# EasyEDA Pro project sucaiku.epro

# Schematic bta

## Sheets
1 Master control circuit
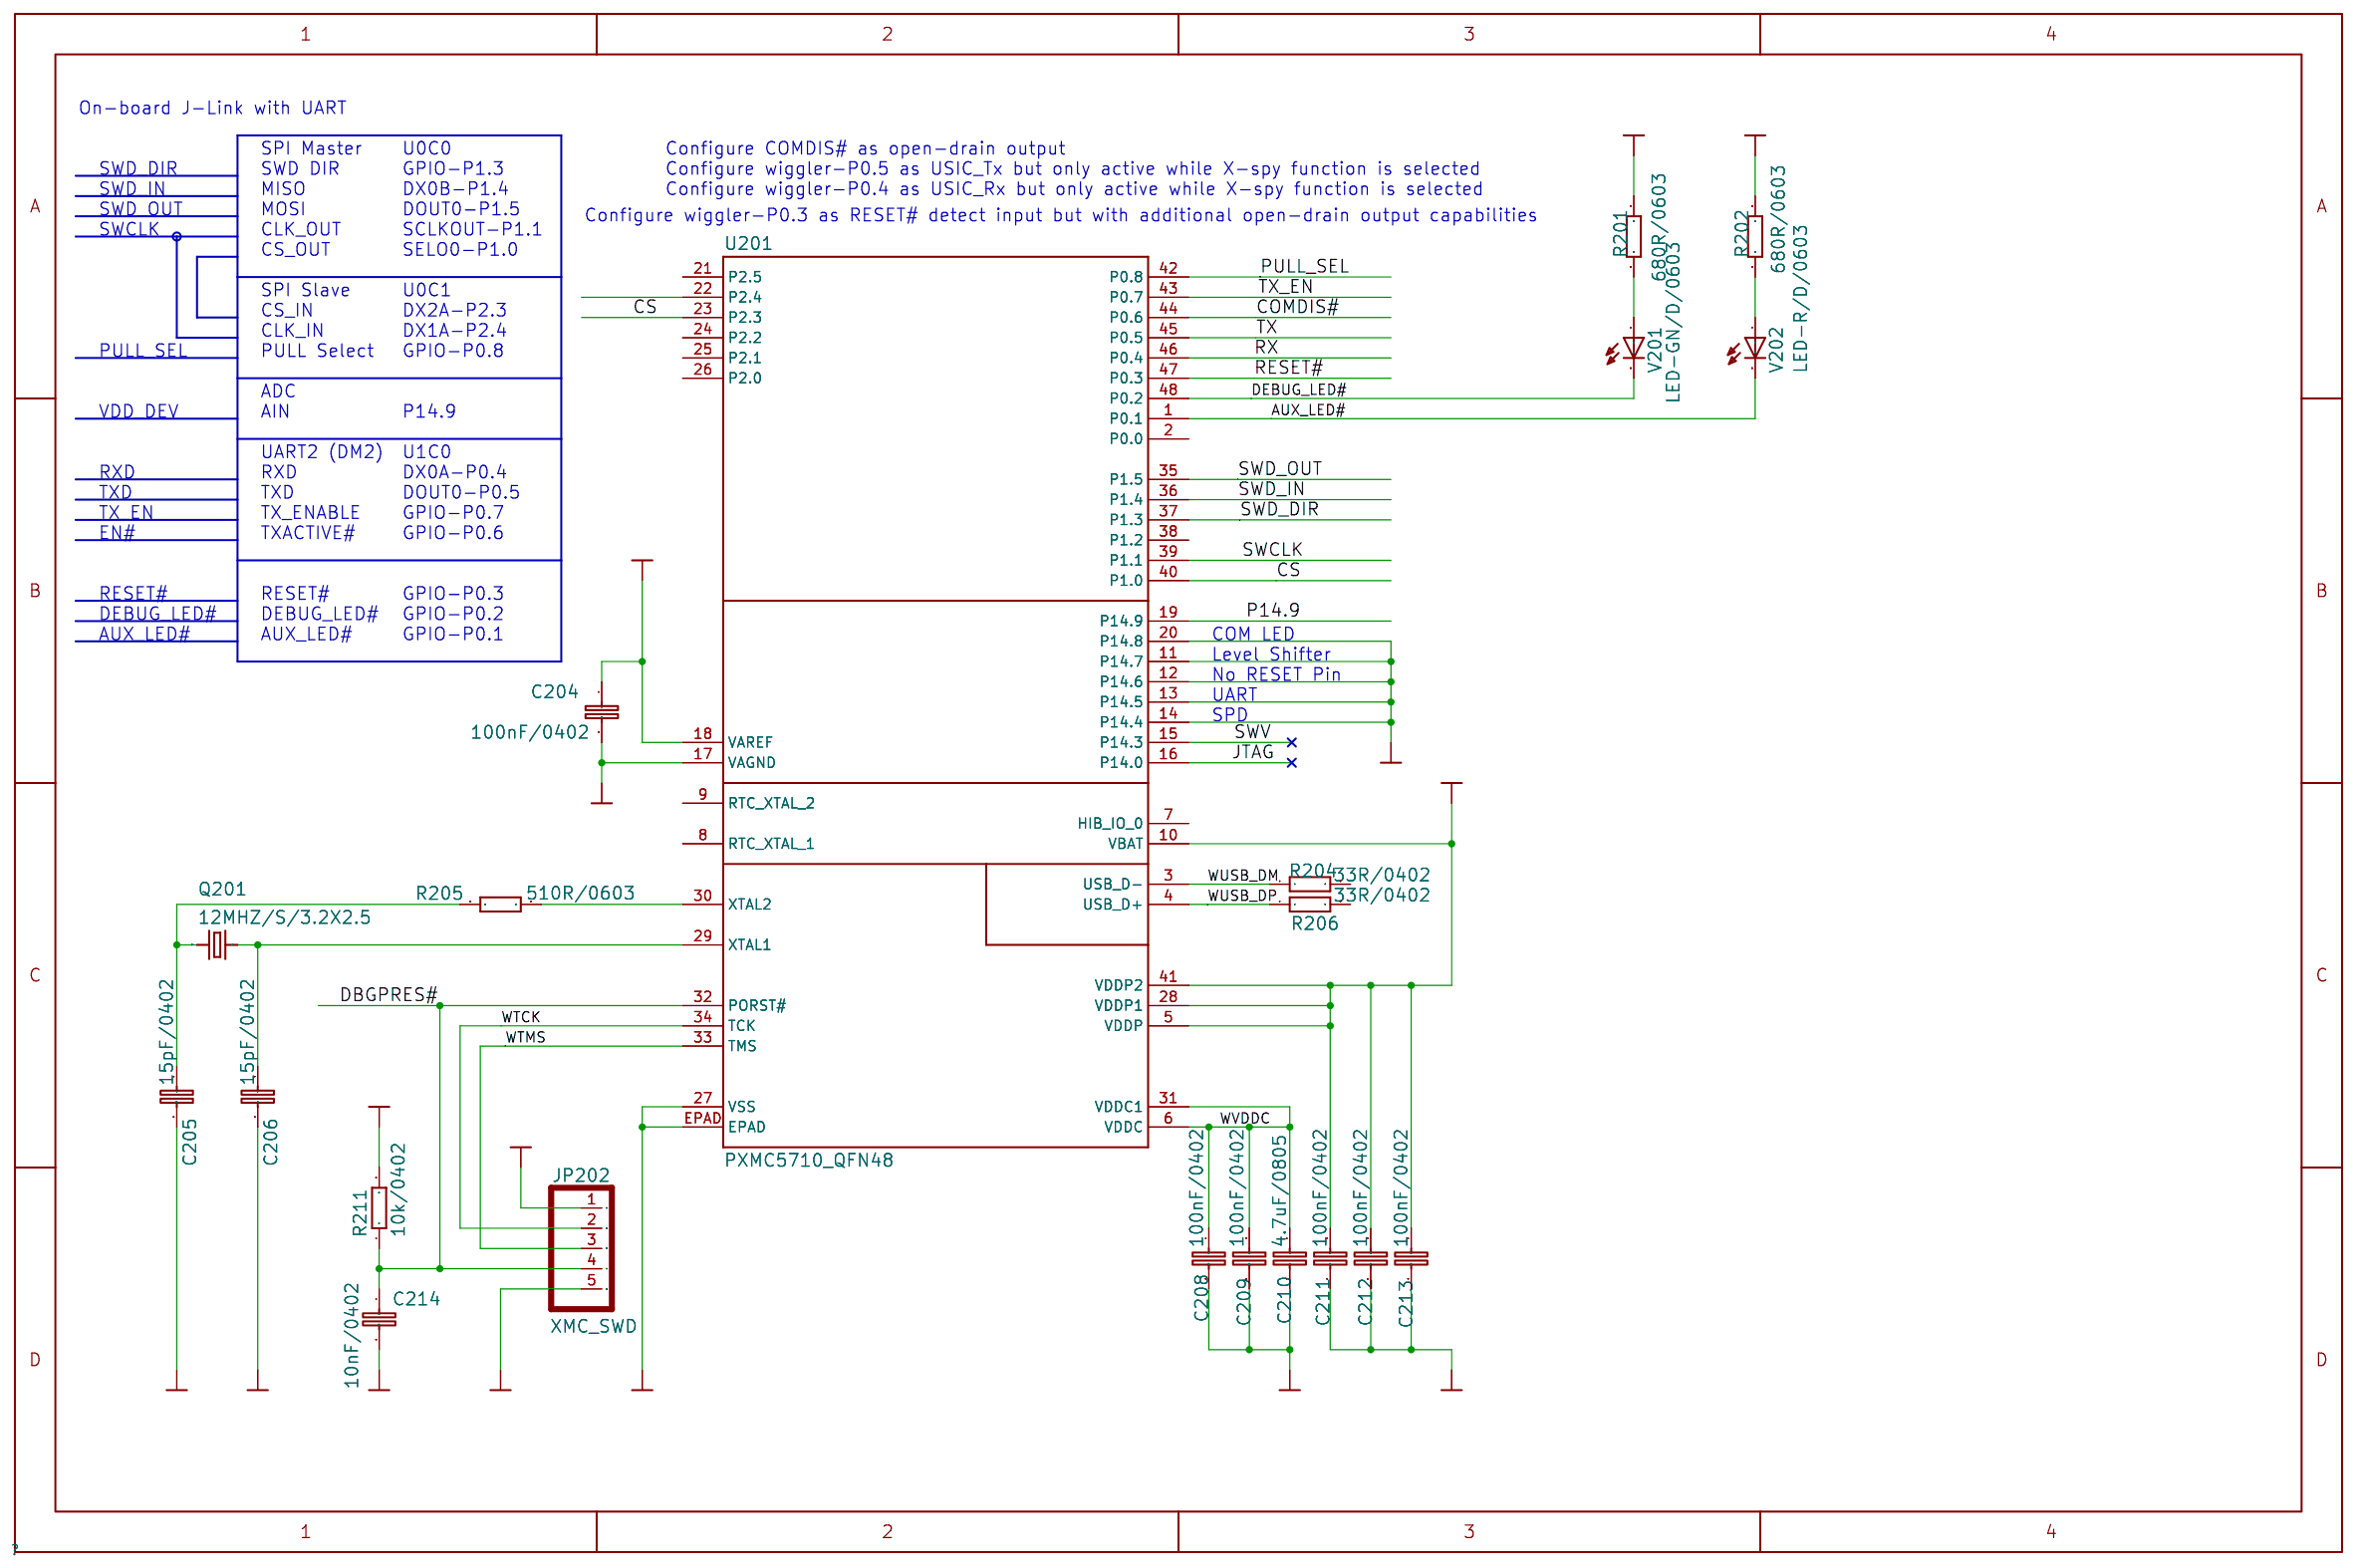
[diagram p0: Master control circuit]
2 Potentiometer and LEDs
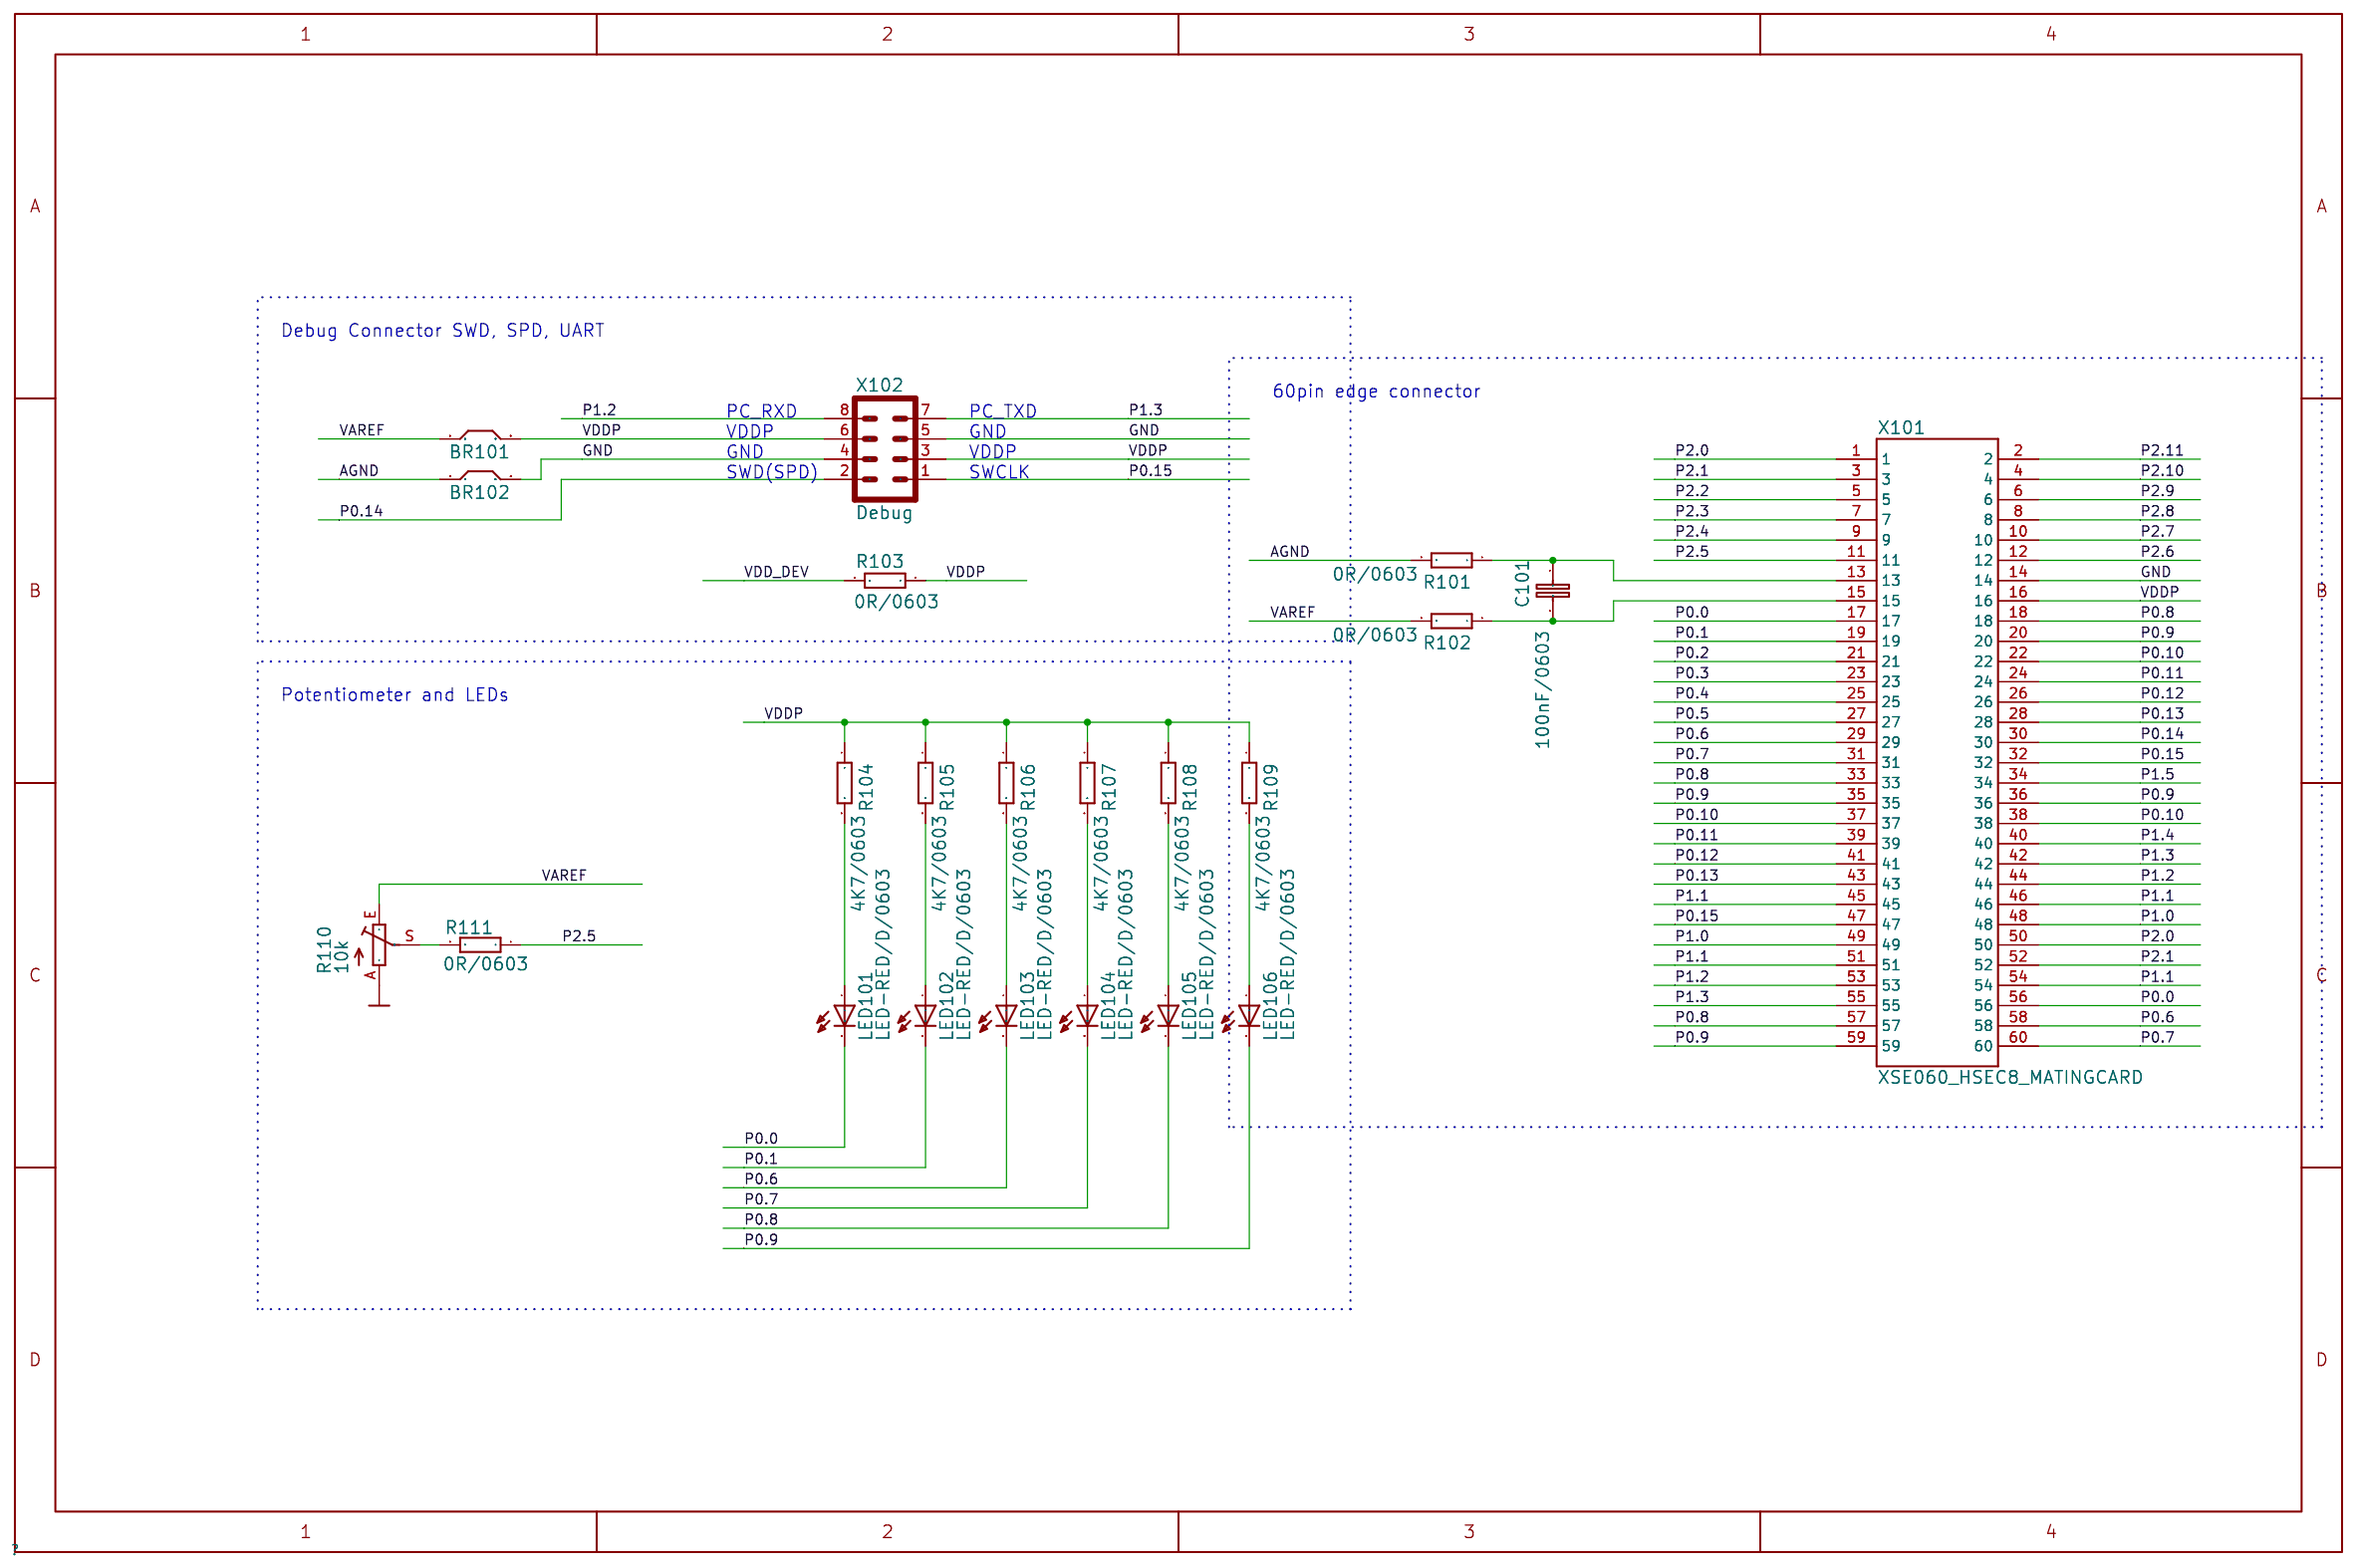
[diagram p1: Potentiometer and LEDs]
3 Power Supply
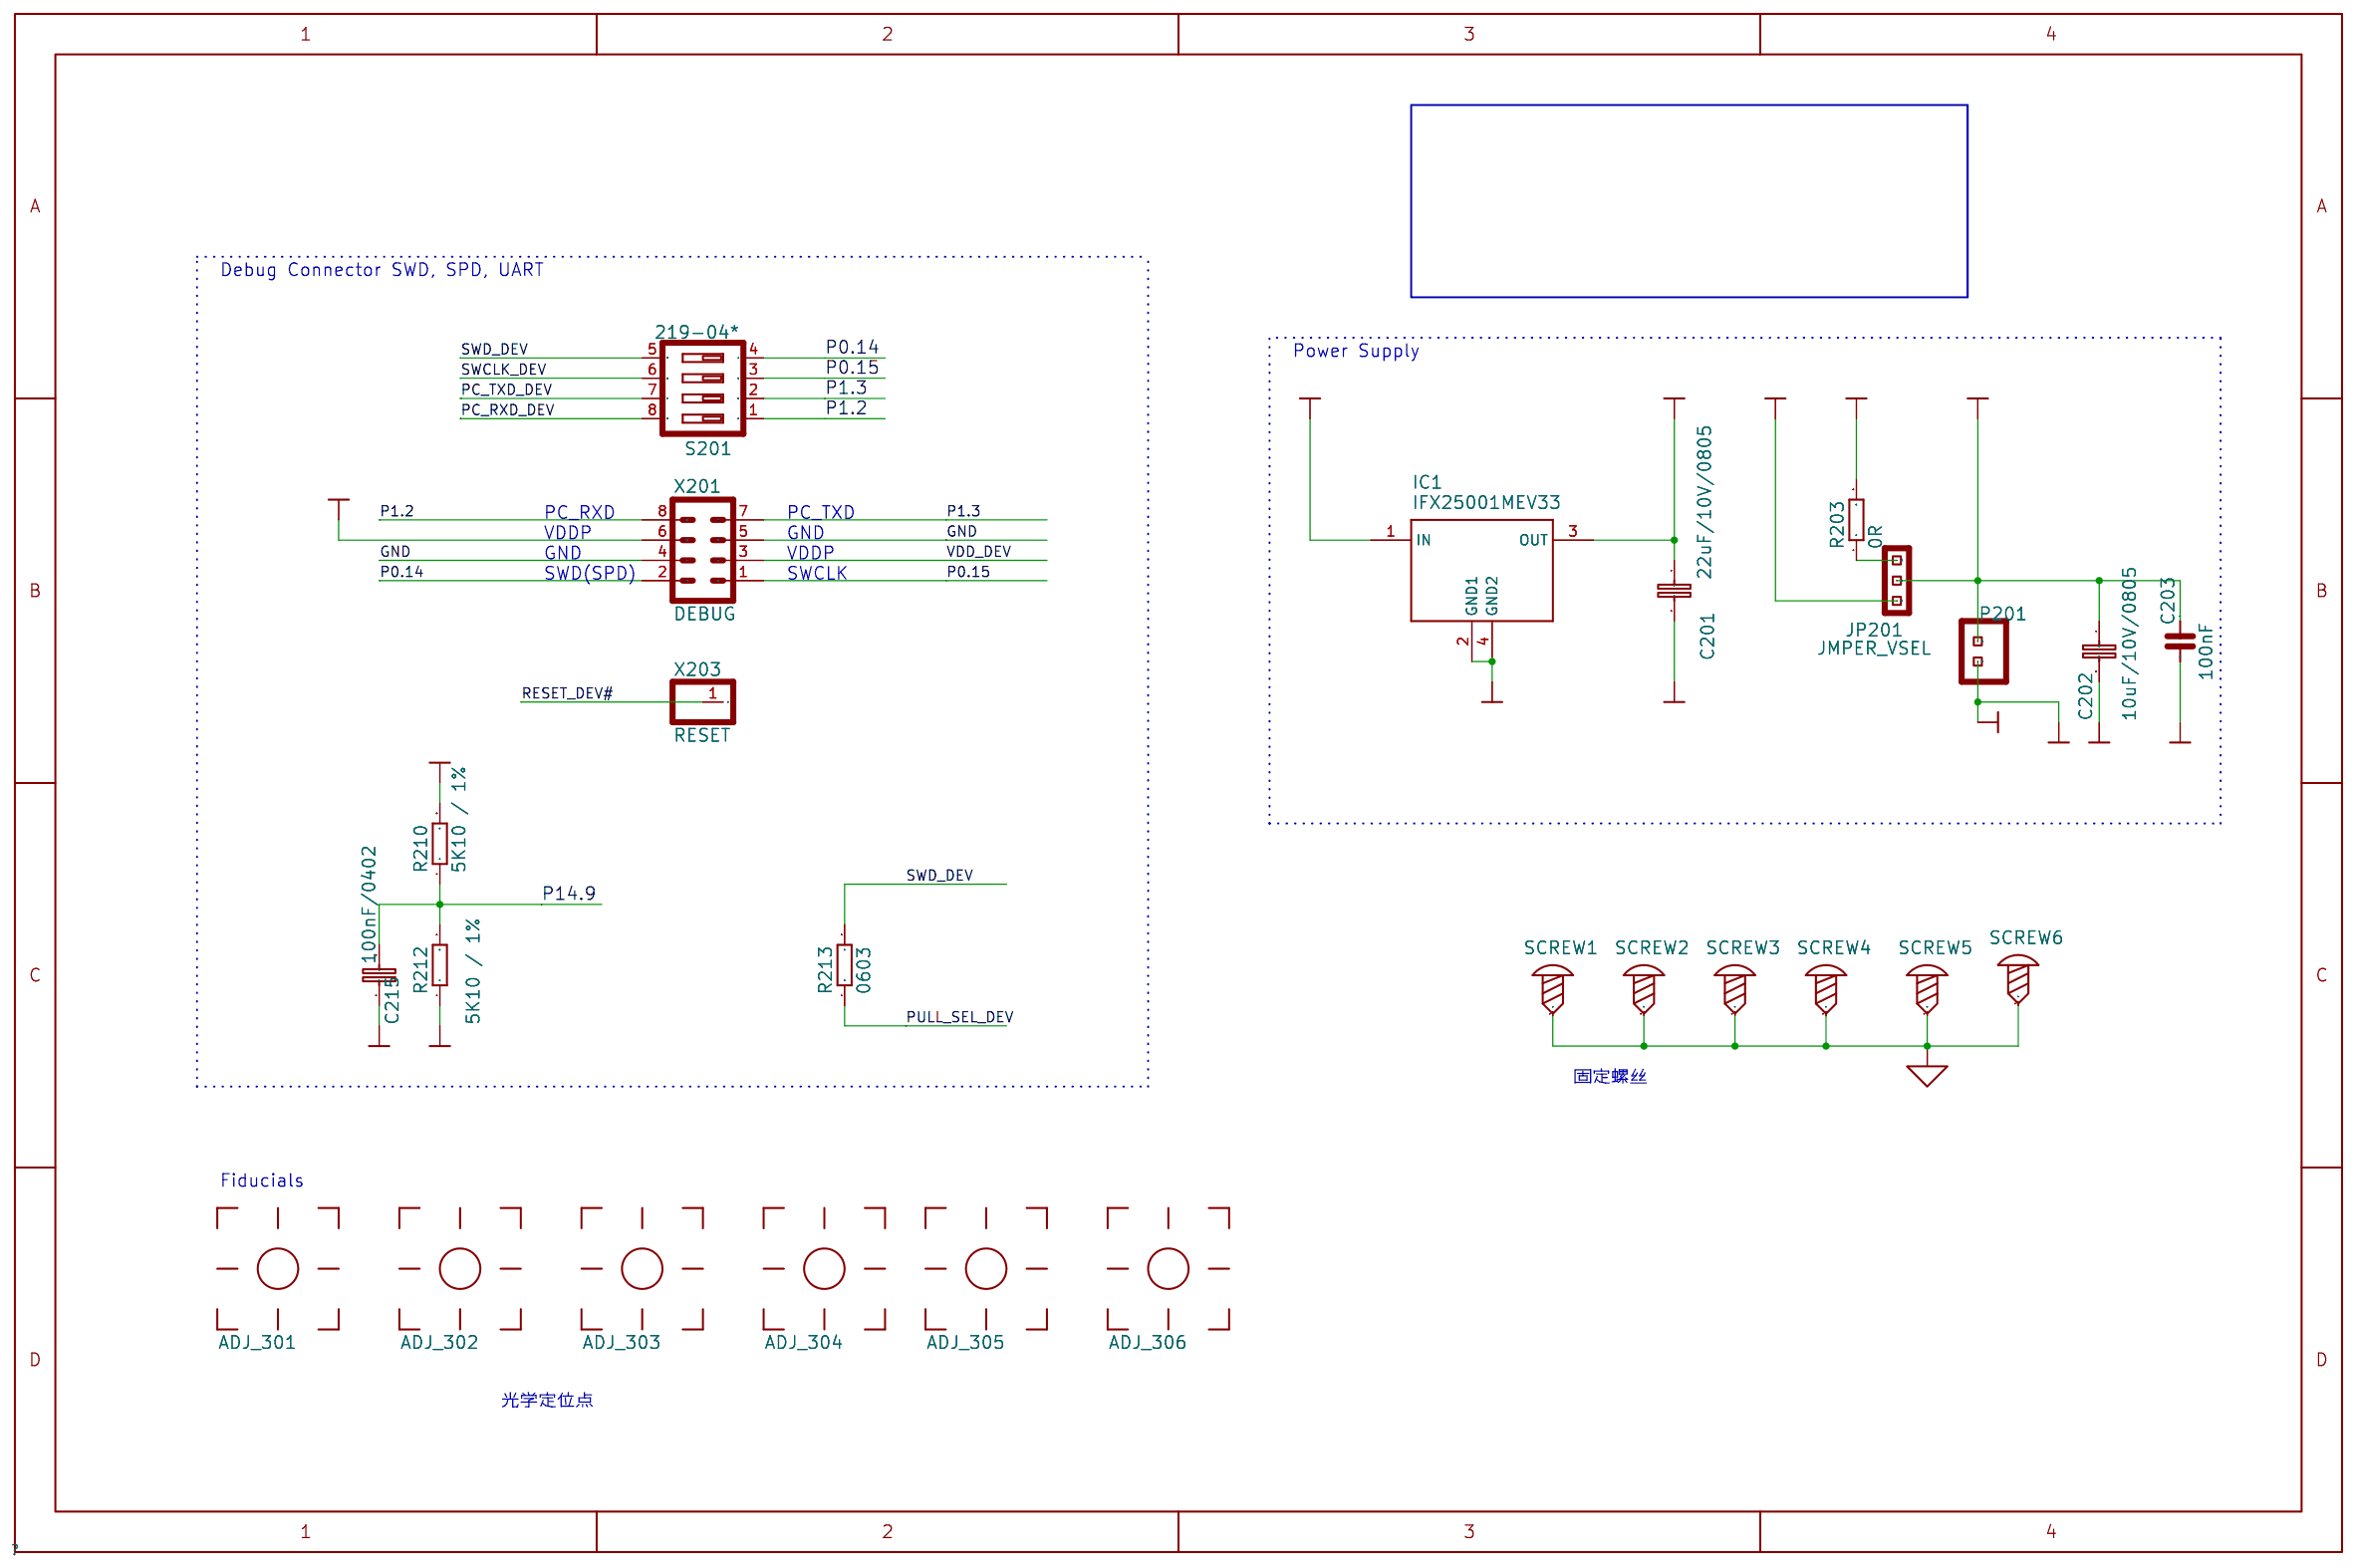
[diagram p2: Power Supply]
4 PXMC
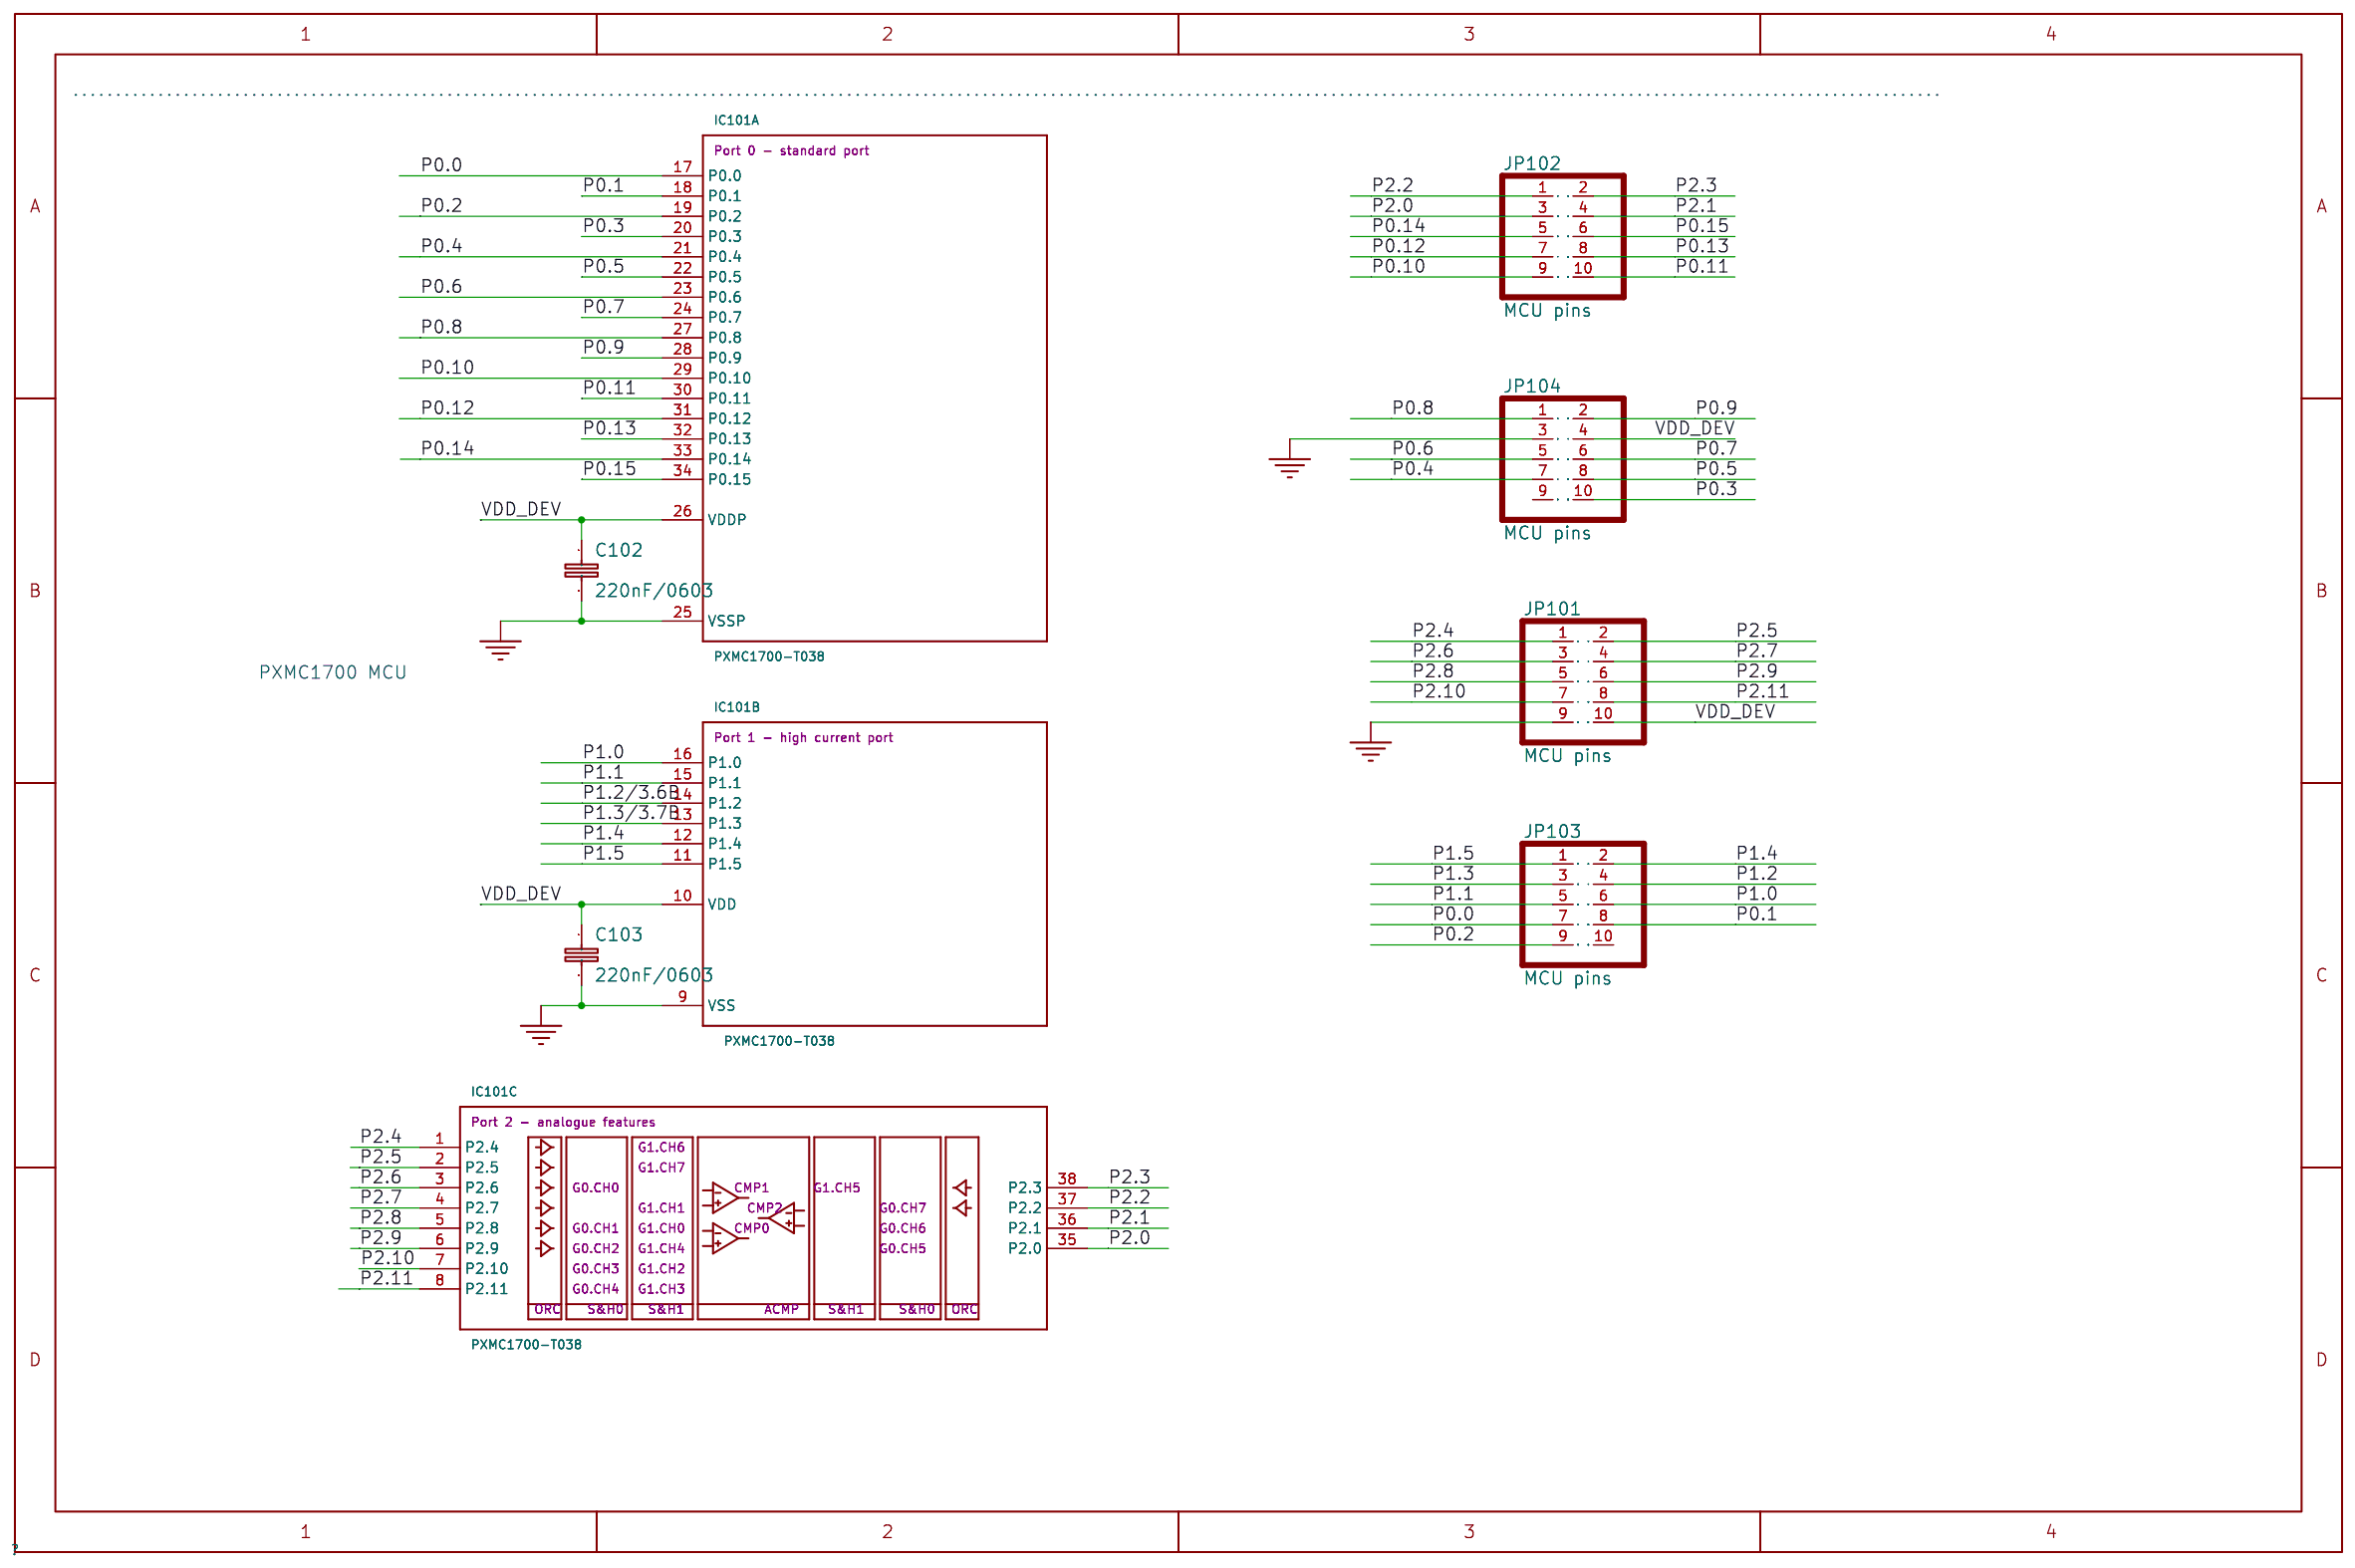
[diagram p3: PXMC]
5 Voltage Translators
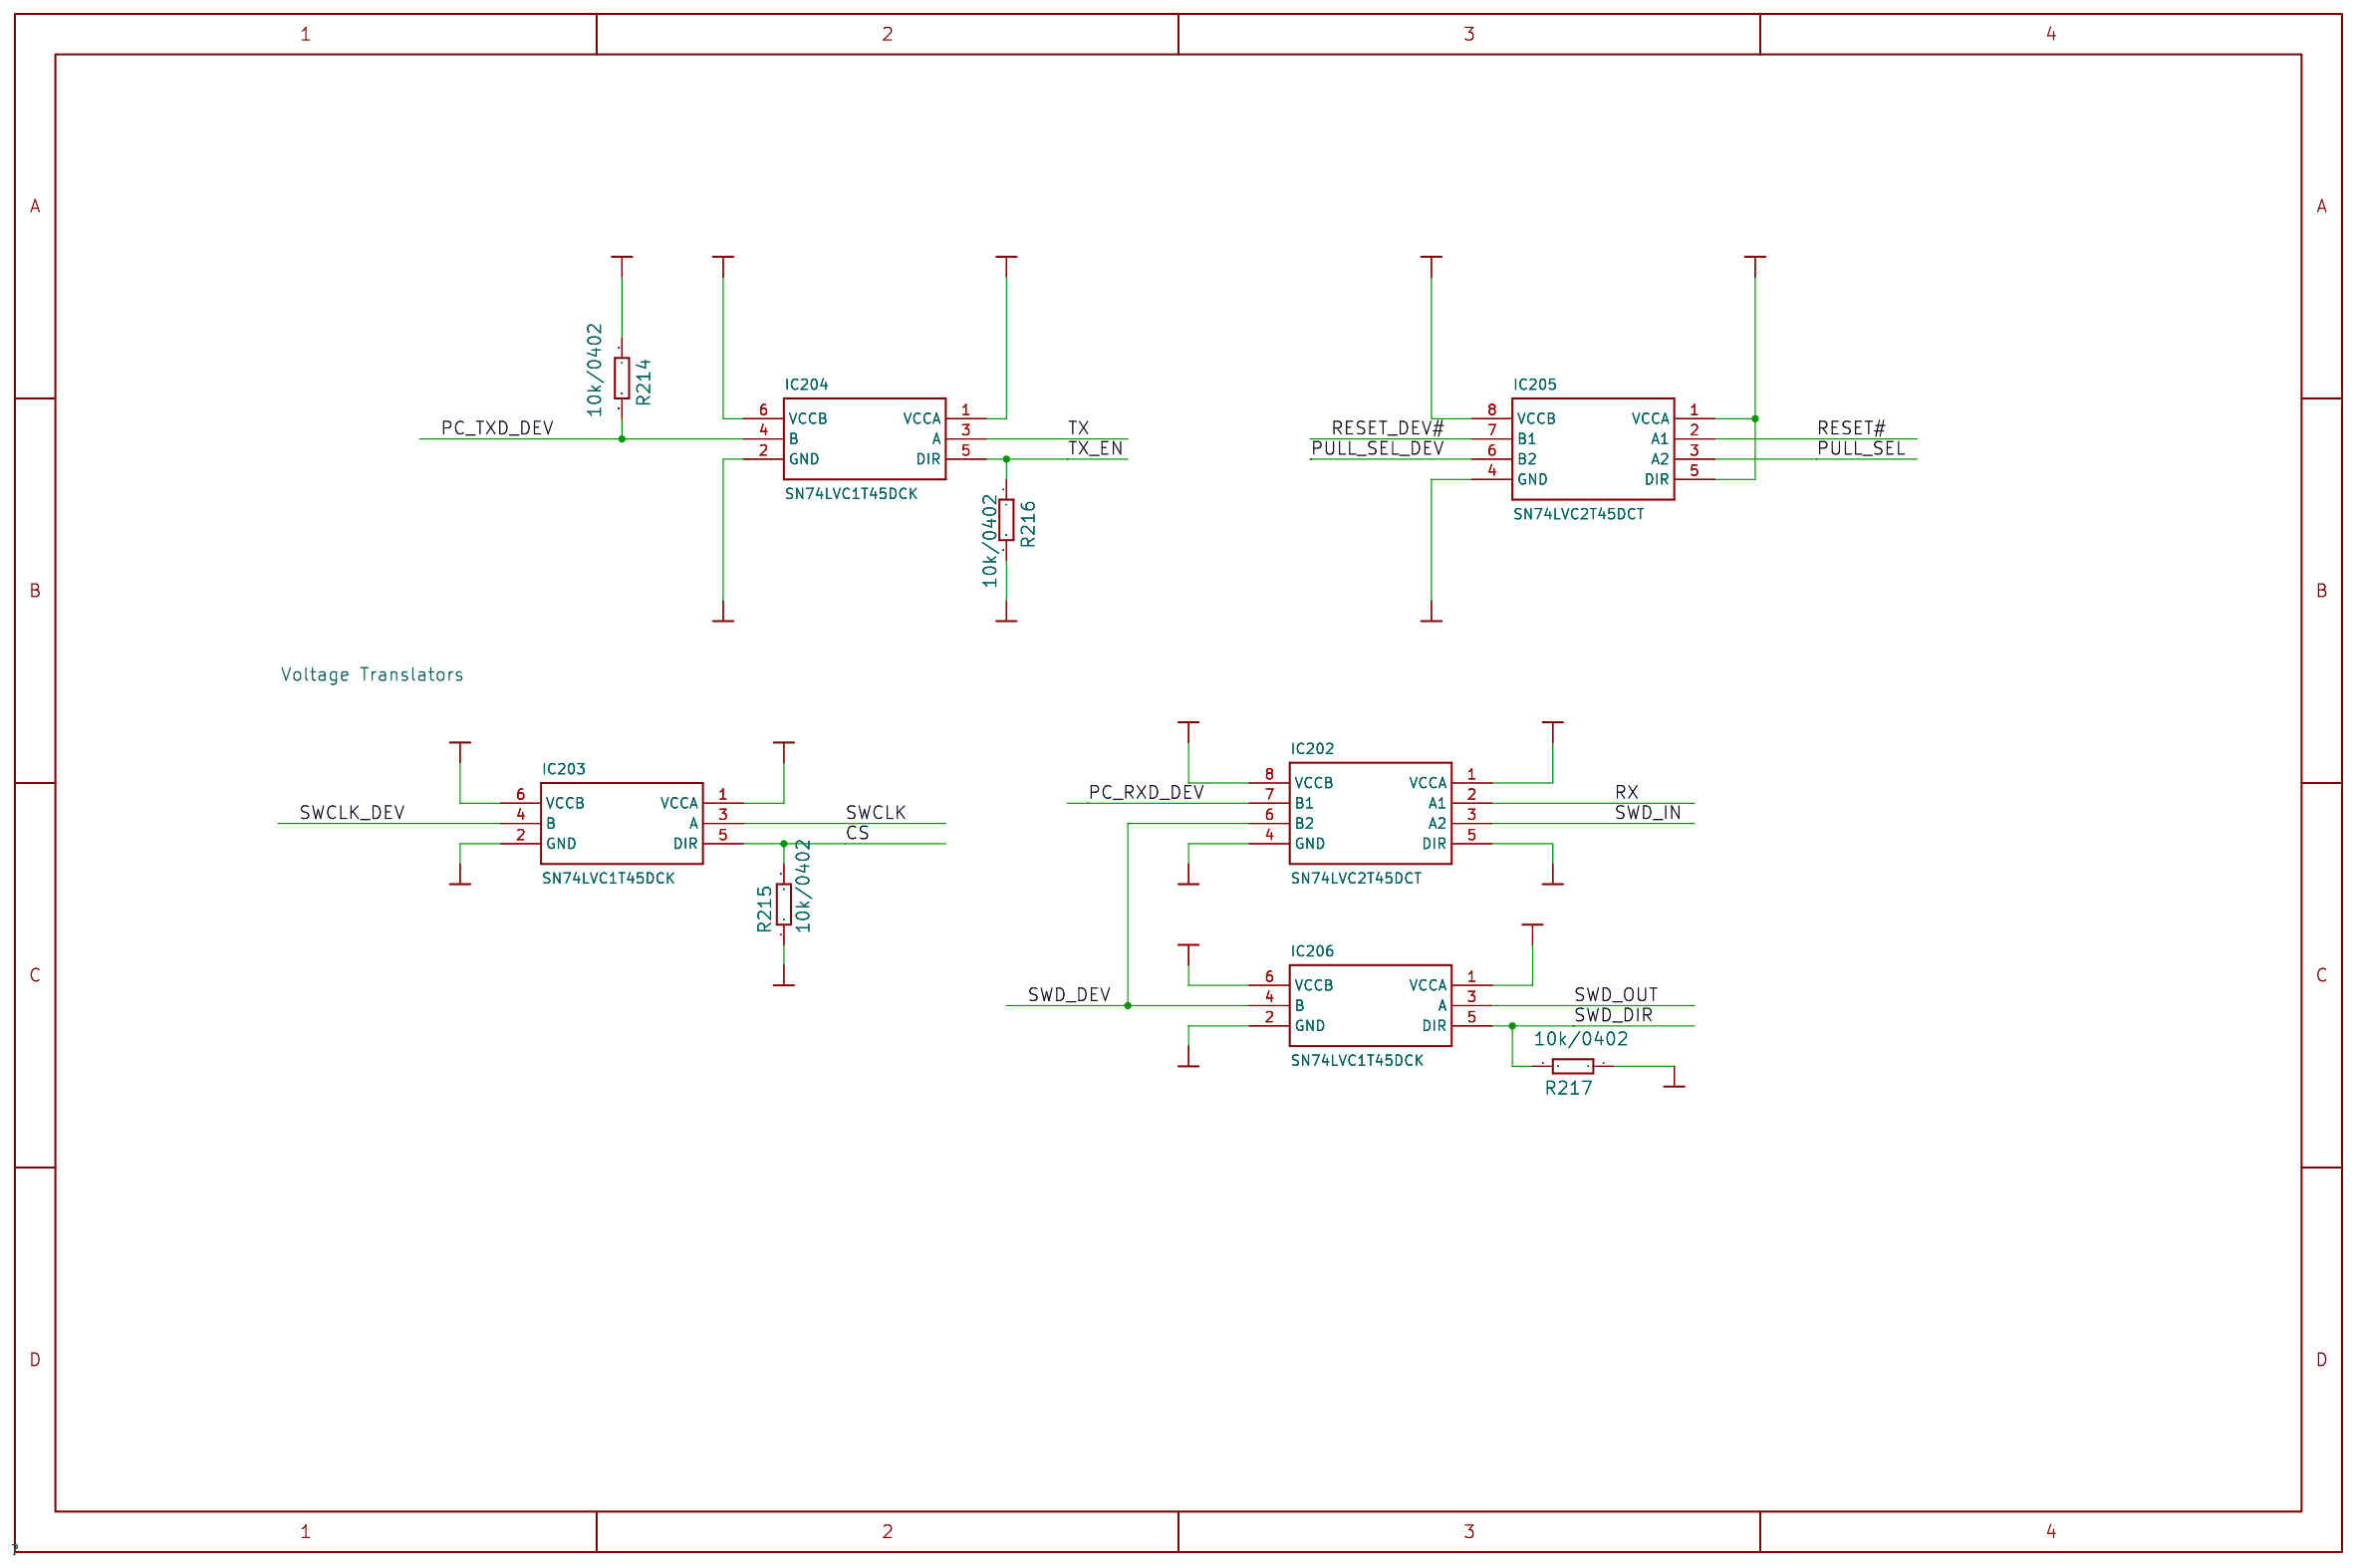
[diagram p4: Voltage Translators]

## Parts
sheet Master control circuit
C204  100nF/0402  [C0402]
C205  15pF/0402  [C0402]
C206  15pF/0402  [C0402]
C208  100nF/0402  [C0402]
C209  100nF/0402  [C0402]
C210  4.7uF/0805  [C0805K]
C211  100nF/0402  [C0402]
C212  100nF/0402  [C0402]
C213  100nF/0402  [C0402]
C214  10nF/0402  [C0402]
JP202  XMC_SWD  [1X05]
Q201  12MHZ/S/3.2X2.5  [32X25_2PAD]
R201  680R/0603  [R0603]
R202  680R/0603  [R0603]
R204  33R/0402  [R0402]
R205  510R/0603  [R0603]
R206  33R/0402  [R0402]
R211  10k/0402  [R0402]
U201  PXMC5710_QFN48  [QFN-48-7X7]
V201  LED-GN/D/0603  [CHIPLED_0603]
V202  LED-R/D/0603  [CHIPLED_0603]
sheet Potentiometer and LEDs
BR101  BRIDGE12X12  [BRIDGE12]
BR102  BRIDGE12X12  [BRIDGE12]
C101  100nF/0603  [RCL_C0603]
LED101  LED-RED/D/0603  [LED_CHIP-LED0603]
LED102  LED-RED/D/0603  [LED_CHIP-LED0603]
LED103  LED-RED/D/0603  [LED_CHIP-LED0603]
LED104  LED-RED/D/0603  [LED_CHIP-LED0603]
LED105  LED-RED/D/0603  [LED_CHIP-LED0603]
LED106  LED-RED/D/0603  [LED_CHIP-LED0603]
R101  0R/0603  [DSR_R0603]
R102  0R/0603  [DSR_R0603]
R103  0R/0603  [DSR_R0603]
R104  4K7/0603  [DSR_R0603]
R105  4K7/0603  [DSR_R0603]
R106  4K7/0603  [DSR_R0603]
R107  4K7/0603  [DSR_R0603]
R108  4K7/0603  [DSR_R0603]
R109  4K7/0603  [DSR_R0603]
R110  10k  [B25P]
R111  0R/0603  [DSR_R0603]
X101  XSE060_HSEC8_MATINGCARD  [XSE060_HSEC8_MATINGCARD_60]
X102  Debug  [MA04-2]
sheet Power Supply
ADJ_301  FIDUCIAL  [FIDUCIAL]
ADJ_302  FIDUCIAL  [FIDUCIAL]
ADJ_303  FIDUCIAL  [FIDUCIAL]
ADJ_304  FIDUCIAL  [FIDUCIAL]
ADJ_305  FIDUCIAL  [FIDUCIAL]
ADJ_306  FIDUCIAL  [FIDUCIAL]
C201  22uF/10V/0805  [C0805K]
C202  10uF/10V/0805  [C0805K]
C203  100nF  [0603]
C215  100nF/0402  [C0402]
IC1  IFX25001MEV33  [SOT223R_INFINEON]
JP201  JMPER_VSEL  [JUMPER_VSEL]
P201  SUPPLY-PADS  [SUPPLY-PADS]
R203  0R  [R0603]
R210  5K10 / 1%  [R0603]
R212  5K10 / 1%  [R0603]
R213  0603  [R0603]
S201  219-04*  [CTS-219-04]
SCREW1  1  [M3]
SCREW2  1  [M3]
SCREW3  1  [M3]
SCREW4  1  [M3]
SCREW5  1  [M3]
SCREW6  1  [M3]
X201  DEBUG  [MA04-2]
X203  RESET  [1X01]
sheet PXMC
C102  220nF/0603  [RCL_C0603]
C103  220nF/0603  [RCL_C0603]
IC101  PXMC1700-T038  [P-TSSOP38-9]  (sections 1,2,3)
JP101  MCU pins  [2X05]
JP102  MCU pins  [2X05]
JP103  MCU pins  [2X05]
JP104  MCU pins  [2X05]
sheet Voltage Translators
IC202  SN74LVC2T45DCT  [DCT_R-PDSO-G8]
IC203  SN74LVC1T45DCK  [DCK_R-PDSO-G6]
IC204  SN74LVC1T45DCK  [DCK_R-PDSO-G6]
IC205  SN74LVC2T45DCT  [DCT_R-PDSO-G8]
IC206  SN74LVC1T45DCK  [DCK_R-PDSO-G6]
R214  10k/0402  [R0402]
R215  10k/0402  [R0402]
R216  10k/0402  [R0402]
R217  10k/0402  [R0402]

## Library data of the parts
C204-C206 C208 C209 C211-C215 = C-EUC0402: LibraryName: DsC
C201 C202 C210 = C-EUC0805K: CAPACITOR, European symbol; LibraryName: HMI_OLED-V1
JP202 = PINHD-1X5: PIN HEADER; LibraryName: pinhead
Q201 = NX3225_22PAD: LibraryName: Quarz
R201 R202 R205 = R-EU_R0603: LibraryName: DsR
R204 R206 R211 R214-R217 = R-EU_R0402: LibraryName: DsR
U201 = XMC4200_QFN48: LibraryName: XMC4000_v4.16
V201 V202 = LEDCHIPLED_0603: LED   OSRAM: - CHIPLED LG R971, LG N971, LY N971, LG Q971, LY Q971, LO R971, LY R971 LH N974, LH R974 LS Q976, LO Q976, LY Q976 LO Q996 - Hyper CHIPLED LW Q18S LB Q993, LB Q99A, LB R99A - SideLED LS A670, LO A670, LY A670, LG A670, LP A670 LB A673, LV A673, LT A673, LW A673 LH A674 LY A675 LS A676, LA A676, LO A676, LY A676, LW A676 LS A679, LY A679, LG A679 -  Hyper Micro SIDELED- LS Y876, LA Y876, LO Y876, LY Y876 LT Y87S - SmartLED LW L88C, LW L88S LB L89C, LB L89S, LG L890 LS L89K, LO L89K, LY L89K LS L896, LA L896, LO L896, LY L896 - TOPLED LS T670, LO T670, LY T670, LG T670, LP T670 LSG T670, LSP T670, LSY T670, LOP T670, LYG T670 LG T671, LOG T671, LSG T671 LB T673, LV T673, LT T673, LW T673 LH T674 LS T676, LA T676, LO T676, LY T676, LB T676, LH T676, LSB T676, LW T676 LB T67C, LV T67C, LT T67C, LS T67K, LO T67K, LY T67K, LW E67C LS E67B, LA E67B, LO E67B, LY E67B, LB E67C, LV E67C, LT E67C LW T67C LS T679, LY T679, LG T679 LS T770, LO T770, LY T770, LG T770, LP T770 LB T773, LV T773, LT T773, LW T773 LH T774 LS E675, LA E675, LY E675, LS T675 LS T776, LA T776, LO T776, LY T776, LB T776 LHGB T686 LT T68C, LB T68C - Hyper Mini TOPLED- LB M676 - Mini TOPLED Santana- LG M470 LS M47K, LO M47K, LY M47K    Source: http://www.osram.convergy.de   LUXEON: - LUMILED- LXK2-PW12-R00, LXK2-PW12-S00, LXK2-PW14-U00, LXK2-PW14-V00 LXK2-PM12-R00, LXK2-PM12-S00, LXK2-PM14-U00 LXK2-PE12-Q00, LXK2-PE12-R00, LXK2-PE12-S00, LXK2-PE14-T00, LXK2-PE14-U00 LXK2-PB12-K00, LXK2-PB12-L00, LXK2-PB12-M00, LXK2-PB14-N00, LXK2-PB14-P00, LXK2-PB14-Q00 LXK2-PR12-L00, LXK2-PR12-M00, LXK2-PR14-Q00, LXK2-PR14-R00 LXK2-PD12-Q00, LXK2-PD12-R00, LXK2-PD12-S00 LXK2-PH12-R00, LXK2-PH12-S00 LXK2-PL12-P00, LXK2-PL12-Q00, LXK2-PL12-R00    Source: www.luxeon.com   KINGBRIGHT:   KA-3528ASYC Source: www.kingbright.com; LibraryName: led
BR101 BR102 = BRIDGE12X12: LibraryName: special
C101-C103 = RCL_C-EUC0603: CAPACITOR, European symbol; LibraryName: CPU_45A-V2
LED101-LED106 = LED_LEDCHIP-LED0603: LED   OSRAM: - CHIPLED LG R971, LG N971, LY N971, LG Q971, LY Q971, LO R971, LY R971 LH N974, LH R974 LS Q976, LO Q976, LY Q976 LO Q996 - Hyper CHIPLED LW Q18S LB Q993, LB Q99A, LB R99A - SideLED LS A670, LO A670, LY A670, LG A670, LP A670 LB A673, LV A673, LT A673, LW A673 LH A674 LY A675 LS A676, LA A676, LO A676, LY A676, LW A676 LS A679, LY A679, LG A679 -  Hyper Micro SIDELED- LS Y876, LA Y876, LO Y876, LY Y876 LT Y87S - SmartLED LW L88C, LW L88S LB L89C, LB L89S, LG L890 LS L89K, LO L89K, LY L89K LS L896, LA L896, LO L896, LY L896 - TOPLED LS T670, LO T670, LY T670, LG T670, LP T670 LSG T670, LSP T670, LSY T670, LOP T670, LYG T670 LG T671, LOG T671, LSG T671 LB T673, LV T673, LT T673, LW T673 LH T674 LS T676, LA T676, LO T676, LY T676, LB T676, LH T676, LSB T676, LW T676 LB T67C, LV T67C, LT T67C, LS T67K, LO T67K, LY T67K, LW E67C LS E67B, LA E67B, LO E67B, LY E67B, LB E67C, LV E67C, LT E67C LW T67C LS T679, LY T679, LG T679 LS T770, LO T770, LY T770, LG T770, LP T770 LB T773, LV T773, LT T773, LW T773 LH T774 LS E675, LA E675, LY E675, LS T675 LS T776, LA T776, LO T776, LY T776, LB T776 LHGB T686 LT T68C, LB T68C - Hyper Mini TOPLED- LB M676 - Mini TOPLED Santana- LG M470 LS M47K, LO M47K, LY M47K    Source: http://www.osram.convergy.de   - LUMILED- LXK2-PW12-R00, LXK2-PW12-S00, LXK2-PW14-U00, LXK2-PW14-V00 LXK2-PM12-R00, LXK2-PM12-S00, LXK2-PM14-U00 LXK2-PE12-Q00, LXK2-PE12-R00, LXK2-PE12-S00, LXK2-PE14-T00, LXK2-PE14-U00 LXK2-PB12-K00, LXK2-PB12-L00, LXK2-PB12-M00, LXK2-PB14-N00, LXK2-PB14-P00, LXK2-PB14-Q00 LXK2-PR12-L00, LXK2-PR12-M00, LXK2-PR14-Q00, LXK2-PR14-R00 LXK2-PD12-Q00, LXK2-PD12-R00, LXK2-PD12-S00 LXK2-PH12-R00, LXK2-PH12-S00 LXK2-PL12-P00, LXK2-PL12-Q00, LXK2-PL12-R00    Source: www.luxeon.com; LibraryName: CPU_45A-V2
R101-R109 R111 = DSR_R-EU_R0603: LibraryName: CPU_45A-V2
R110 = TRIM_EU-B25P: POTENTIOMETER; LibraryName: pot
X101 = XSE060_HSEC8_MATINGCARD: LibraryName: TIMM1
X102 X201 = MA04-2_1: PIN HEADER; LibraryName: con-lstb
ADJ_301-ADJ_306 = FIDUCIAL_1: Fiducial   FIDUCIAL: Durchmesser = 0.75mm Kupfer und 1.5mm Lötstopmaske FIDUCIAL 0.5mm: Durchmesser= 0.5mm Kupfer und 1.0mm Lötstopmaske; LibraryName: Global
C203 = CNP-0603: NON-POLARIZED CAP; LibraryName: cap-master
IC1 = IFX25001MEV33: LibraryName: infineon_power
JP201 = JMPER_VSEL: LibraryName: TIMM1
P201 = SUPPLY-PADS_1: LibraryName: TIMM1
R203 R210 R212 R213 = R-EU_R0603: RESISTOR, European symbol; LibraryName: rcl
S201 = 219-04*: Surface Mount DIP Switch Series 219 SMT   CTS Electronic Components Sourc: www.ctscorp.com; LibraryName: switch-dil
SCREW1-SCREW6 = M3螺丝: Supplier Footprint: 插件
X203 = PINHD-1X1: PIN HEADER; LibraryName: pinhead
IC101 = XMC1000-T038: Port0-standardport: Port 0 - standard port; LibraryName: XMC1000
JP101-JP104 = PINHD-2X5: PIN HEADER; LibraryName: pinhead
IC202 IC205 = SN74LVC2T45DCT: LibraryName: SN74LVCxT45
IC203 IC204 IC206 = SN74LVC1T45DCK: LibraryName: SN74LVCxT45

## Nets
+3V3: C201.1 C204.1 C211.1 C212.1 C213.1 IC1.3(OUT) IC202.1(VCCA) IC203.1(VCCA) IC204.1(VCCA) IC205.1(VCCA) IC205.5(DIR) IC206.1(VCCA) JP201.1 JP202.1 R201.1 R202.1 R211.2 U201.5(VDDP) U201.10(VBAT) U201.18(VAREF) U201.28(VDDP1) U201.41(VDDP2)
+5V: IC1.1(IN) R203.2
AGND: BR102.B1 R101.2 R110.A
GND: BR102.B2 C102.2 C103.2 C201.2 C202.2 C203.1 C204.2 C205.2 C206.2 C208.2 C209.2 C210.2 C211.2 C212.2 C213.2 C214.2 C215.2 IC1.2(GND1) IC1.4(GND2) IC101.9(VSS) IC101.25(VSSP) IC202.4(GND) IC202.5(DIR) IC203.2(GND) IC204.2(GND) IC205.4(GND) IC206.2(GND) JP101.9 JP104.3 JP202.5 P201.2 R212.1 R215.1 R216.2 R217.1 U201.11(P14.7) U201.12(P14.6) U201.13(P14.5) U201.14(P14.4) U201.17(VAGND) U201.20(P14.8) U201.27(VSS) U201.EPAD X101.14 X102.4 X102.5 X201.4 X201.5
VDD_DEV: C102.1 C103.1 C202.1 C203.2 IC101.10(VDD) IC101.26(VDDP) IC202.8(VCCB) IC203.6(VCCB) IC204.6(VCCB) IC205.8(VCCB) IC206.6(VCCB) JP101.10 JP104.4 JP201.2 P201.1 R103.2 R210.2 R214.1 X201.3 X201.6
VDDP: BR101.B2 R103.1 R104.1 R105.1 R106.1 R107.1 R108.1 R109.1 X101.16 X102.3 X102.6
AUX_LED#: U201.1(P0.1) V202.C
COMDIS#: U201.44(P0.6)
CS: IC203.5(DIR) R215.2 U201.23(P2.3) U201.40(P1.0)
DBGPRES#: C214.1 JP202.4 R211.1 U201.32(PORST#)
DEBUG_LED#: U201.48(P0.2) V201.C
GROUND: SCREW1.1 SCREW2.1 SCREW3.1 SCREW4.1 SCREW5.1 SCREW6.1
JTAG: U201.16(P14.0)
P0.0: IC101.17(P0.0) JP103.7 LED101.C X101.17 X101.56
P0.1: IC101.18(P0.1) JP103.8 LED102.C X101.19
P0.2: IC101.19(P0.2) JP103.9 X101.21
P0.3: IC101.20(P0.3) JP104.10 X101.23
P0.4: IC101.21(P0.4) JP104.7 X101.25
P0.5: IC101.22(P0.5) JP104.8 X101.27
P0.6: IC101.23(P0.6) JP104.5 LED103.C X101.29 X101.58
P0.7: IC101.24(P0.7) JP104.6 LED104.C X101.31 X101.60
P0.8: IC101.27(P0.8) JP104.1 LED105.C X101.18 X101.33 X101.57
P0.9: IC101.28(P0.9) JP104.2 LED106.C X101.20 X101.35 X101.36 X101.59
P0.10: IC101.29(P0.10) JP102.9 X101.22 X101.37 X101.38
P0.11: IC101.30(P0.11) JP102.10 X101.24 X101.39
P0.12: IC101.31(P0.12) JP102.7 X101.26 X101.41
P0.13: IC101.32(P0.13) JP102.8 X101.28 X101.43
P0.14: IC101.33(P0.14) JP102.5 S201.4 X101.30 X102.2 X201.2
P0.15: IC101.34(P0.15) JP102.6 S201.3 X101.32 X101.47 X102.1 X201.1
P1.0: IC101.16(P1.0) JP103.6 X101.48 X101.49
P1.1: IC101.15(P1.1) JP103.5 X101.45 X101.46 X101.51 X101.54
P1.2: JP103.4 S201.1 X101.44 X101.53 X102.8 X201.8
P1.2/3.6B: IC101.14(P1.2)
P1.3: JP103.3 S201.2 X101.42 X101.55 X102.7 X201.7
P1.3/3.7B: IC101.13(P1.3)
P1.4: IC101.12(P1.4) JP103.2 X101.40
P1.5: IC101.11(P1.5) JP103.1 X101.34
P2.0: IC101.35(P2.0) JP102.3 X101.1 X101.50
P2.1: IC101.36(P2.1) JP102.4 X101.3 X101.52
P2.2: IC101.37(P2.2) JP102.1 X101.5
P2.3: IC101.38(P2.3) JP102.2 X101.7
P2.4: IC101.1(P2.4) JP101.1 X101.9
P2.5: IC101.2(P2.5) JP101.2 R111.1 X101.11
P2.6: IC101.3(P2.6) JP101.3 X101.12
P2.7: IC101.4(P2.7) JP101.4 X101.10
P2.8: IC101.5(P2.8) JP101.5 X101.8
P2.9: IC101.6(P2.9) JP101.6 X101.6
P2.10: IC101.7(P2.10) JP101.7 X101.4
P2.11: IC101.8(P2.11) JP101.8 X101.2
P14.9: C215.1 R210.1 R212.2 U201.19(P14.9)
PC_RXD_DEV: IC202.7(B1) S201.8
PC_TXD_DEV: IC204.4(B) R214.2 S201.7
PULL_SEL: IC205.3(A2) U201.42(P0.8)
PULL_SEL_DEV: IC205.6(B2) R213.1
RESET#: IC205.2(A1) U201.47(P0.3)
RESET_DEV#: IC205.7(B1) X203.1
RX: IC202.2(A1) U201.46(P0.4)
SWCLK: IC203.3(A) U201.39(P1.1)
SWCLK_DEV: IC203.4(B) S201.6
SWD_DEV: IC202.6(B2) IC206.4(B) R213.2 S201.5
SWD_DIR: IC206.5(DIR) R217.2 U201.37(P1.3)
SWD_IN: IC202.3(A2) U201.36(P1.4)
SWD_OUT: IC206.3(A) U201.35(P1.5)
SWV: U201.15(P14.3)
TX: IC204.3(A) U201.45(P0.5)
TX_EN: IC204.5(DIR) R216.1 U201.43(P0.7)
VAREF: BR101.B1 R102.2 R110.E
WTCK: JP202.2 U201.34(TCK)
WTMS: JP202.3 U201.33(TMS)
WUSB_DM: R204.1 U201.3(USB_D-)
WUSB_DP: R206.1 U201.4(USB_D+)
WVDDC: C208.1 C209.1 C210.1 U201.6(VDDC) U201.31(VDDC1)
Net-(C101-1): C101.1 R101.1 X101.13
Net-(C101-2): C101.2 R102.1 X101.15
Net-(C205-1): C205.1 Q201.2 R205.2
Net-(C206-1): C206.1 Q201.1 U201.29(XTAL1)
Net-(JP201-3): JP201.3 R203.1
Net-(LED101-A): LED101.A R104.2
Net-(LED102-A): LED102.A R105.2
Net-(LED103-A): LED103.A R106.2
Net-(LED104-A): LED104.A R107.2
Net-(LED105-A): LED105.A R108.2
Net-(LED106-A): LED106.A R109.2
Net-(R110-S): R110.S R111.2
Net-(R201-2): R201.2 V201.A
Net-(R202-2): R202.2 V202.A
Net-(R205-1): R205.1 U201.30(XTAL2)

Not connected (* = marked no-connect by the designer): JP103 10; JP104 9; R204 2; R206 2; U201 2(P0.0) 7(HIB_IO_0) 8(RTC_XTAL_1) 9(RTC_XTAL_2) 21(P2.5) 22(P2.4) 24(P2.2) 25(P2.1) 26(P2.0) 38(P1.2)

## Notes on the sheets
sheet 1
- On-board J-Link with UART
- SPI Master
- U0C0
- Configure COMDIS# as open-drain output
- SWD_DIR
- SWD DIR
- GPIO-P1.3
- Configure wiggler-P0.5 as USIC_Tx but only active while X-spy function is selected
- SWD_IN
- MISO
- DX0B-P1.4
- Configure wiggler-P0.4 as USIC_Rx but only active while X-spy function is selected
- SWCLK
- SWD_OUT
- CLK_OUT
- MOSI
- DOUT0-P1.5
- SCLKOUT-P1.1
- Configure wiggler-P0.3 as RESET# detect input but with additional open-drain output capabilities
- CS_OUT
- SELO0-P1.0
- SPI Slave
- U0C1
- CS_IN
- DX2A-P2.3
- PULL_SEL
- CLK_IN
- PULL Select
- DX1A-P2.4
- GPIO-P0.8
- ADC
- VDD_DEV
- AIN
- P14.9
- UART2 (DM2)
- U1C0
- RXD
- TXD
- RXD
- TXD
- DOUT0-P0.5
- DX0A-P0.4
- TX_EN
- TX_ENABLE
- GPIO-P0.7
- EN#
- TXACTIVE#
- GPIO-P0.6
- DEBUG_LED#
- RESET#
- DEBUG_LED#
- RESET#
- GPIO-P0.2
- GPIO-P0.3
- AUX_LED#
- AUX_LED#
- GPIO-P0.1
- COM LED
- Level Shifter
- No RESET Pin
- UART
- SPD
sheet 2
- Debug Connector SWD, SPD, UART
- 60pin edge connector
- PC_RXD
- PC_TXD
- VDDP
- GND
- GND
- VDDP
- SWD(SPD)
- SWCLK
- Potentiometer and LEDs
sheet 3
- Debug Connector SWD, SPD, UART
- Power Supply
- PC_RXD
- PC_TXD
- VDDP
- GND
- GND
- VDDP
- SWD(SPD)
- SWCLK
- 固定螺丝
- Fiducials
- 光学定位点
sheet 4
- PXMC1700 MCU
sheet 5
- Voltage Translators
